# EAGLE design Soil_Sensor_Board (EAGLE 7.4.0)
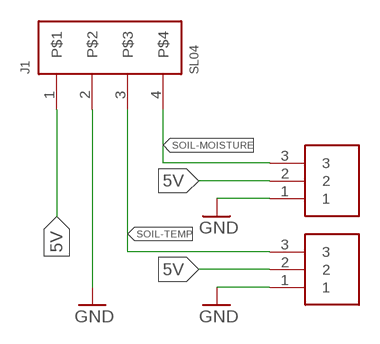
[diagram p0: schematic, sheet 1]

## Parts
J1  SL04  [MOLEX_SL_04_TH]
J2  SL03THROUGH_HOLE  [MOLEX_SL_03_TH]
J3  SL03THROUGH_HOLE  [MOLEX_SL_03_TH]

## Nets
5V: J1.1 J2.2 J3.2
GND: J1.2 J2.1 J3.1
SOIL-MOISTURE: J1.4 J2.3
SOIL-TEMP: J1.3 J3.3

## Library data of the parts
J1 = MRDT-Connectors:SL04
J2 J3 = MRDT-Connectors:SL03: Molex 3-pin SL connector Locking 3 pin connector with standard header spacing. Backward compatible with standard RC servo connectors.; ORIENT: HORIZ; PARTNO: 0705550002

## Board
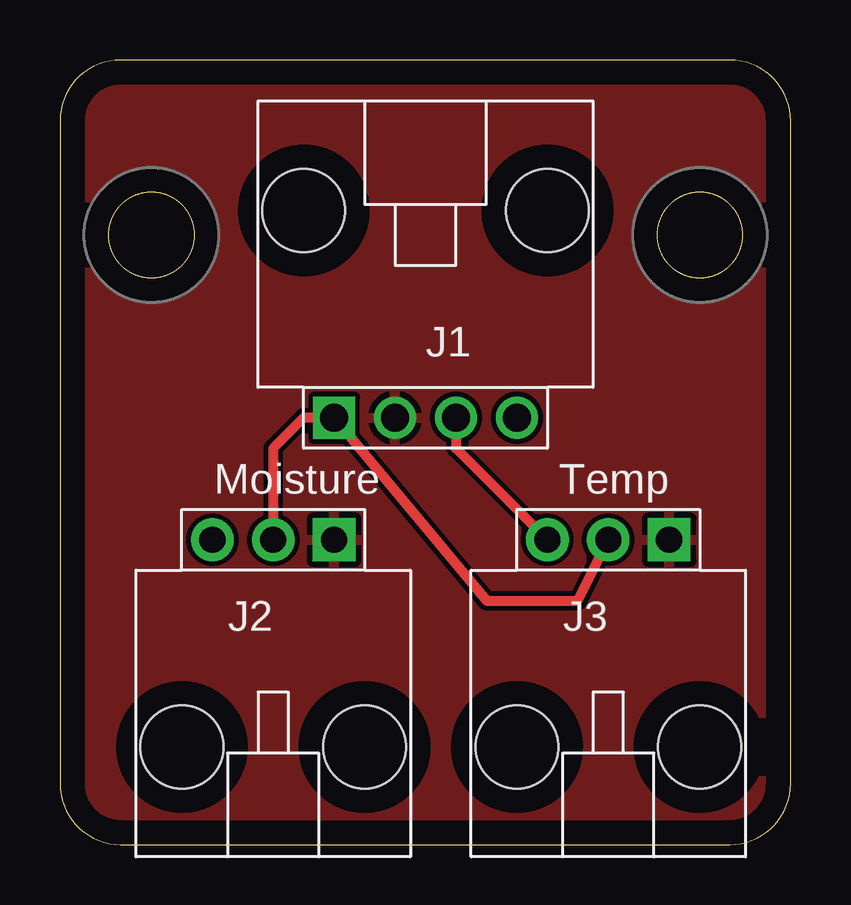
[diagram p1: board, top side]
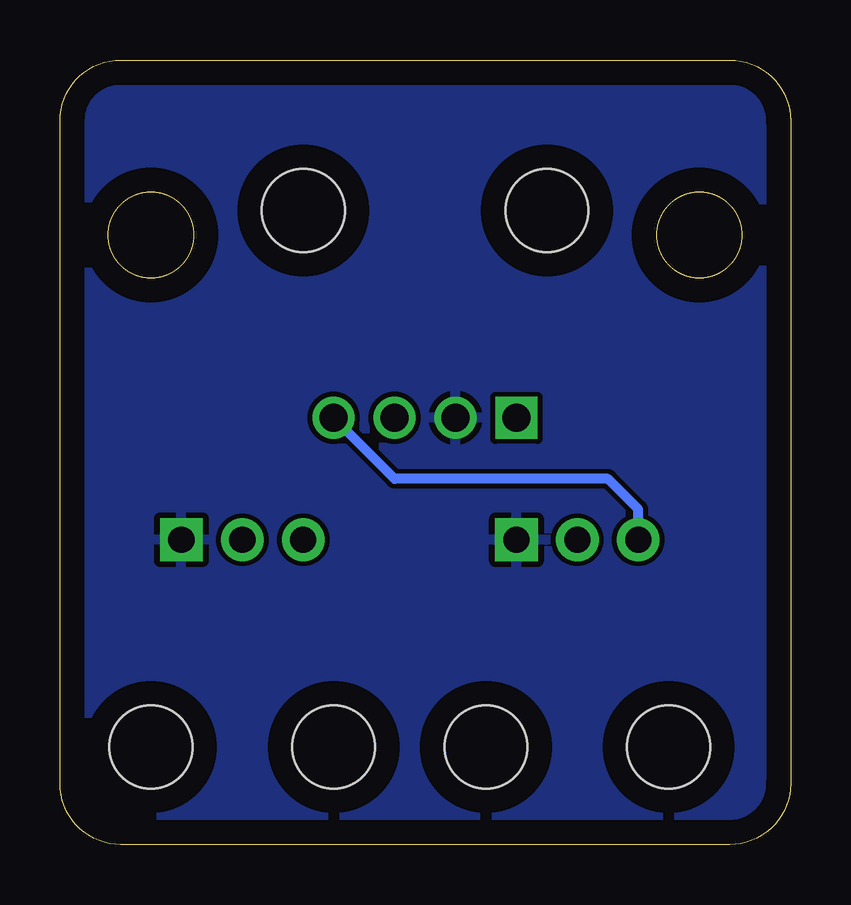
[diagram p2: board, bottom side, seen from below]

Size 30.46 x 32.69 mm. Coordinates in mm from the lower left corner, seen from the top.
Outline: 0,30.15 0,2.54 arc90 2.54,0 27.92,0 arc90 30.46,2.54 30.46,30.15 arc90 27.92,32.69 2.54,32.69 arc90 0,30.15
Copper layers (1*16): Top 0.035mm / dielectric 1.5mm / Bottom 0.035mm
Design rules "default": minimum track width 10mil, minimum drill 24mil, track to track 8mil, track to pad 8mil, pad to pad 8mil, via to via 8mil, smd to smd 8mil, copper to edge 40mil, drill to drill 8mil, minimum pad ring 10mil, minimum via ring 8mil, stop-mask expansion 4mil, vias tented up to drill 0mil, thermal gap 10mil

### Footprints (pad centres in the part's own frame; a part is rotated, then mirrored left to right if it is on the bottom)
MOLEX_SL_04_TH = drill 1.168 square: 1 -3.81,0 | drill 1.168: 2 -1.27,0; 3 1.27,0; 4 3.81,0 | hole 3.454: -5.08,8.636; 5.08,8.636
MOLEX_SL_03_TH = drill 1.092 pad 1.778 square: 1 -2.54,0 | drill 1.092 pad 1.778: 2 0,0; 3 2.54,0 | hole 3.454: -3.81,8.636; 3.81,8.636

### Placement (x,y rotation side)
J1  15.24,17.78 0 top
J2  8.89,12.7 180 top
J3  22.86,12.7 180 top
U$1  [#6_SCREW]  26.67,25.4 0 top
U$2  [#6_SCREW]  3.81,25.4 0 top

### Tracks (layer width: path | path; a pad name or v marks a point on that pad's centre or on a via)
5V
  Top 0.406: J2.2 8.89,16.51 10.16,17.78 J1.1 17.78,10.16 21.59,10.16 J3.2
GND
  pour Bottom: -10.16,34.29 39.37,35.56 38.1,-6.35 -8.89,-8.89
  pour Top: -6.35,36.83 48.26,36.83 45.72,-8.89 -6.35,-10.16
SOIL-MOISTURE
  Bottom 0.406: J2.3 6.35,13.97 7.62,15.24 16.51,15.24 J1.4
SOIL-TEMP
  Top 0.406: J1.3 16.51,16.51 J3.3

### Text on the board
tPlace: Moisture | Temp